# EasyEDA Pro project ProPrj_Dolphin 3D.epro, board PCB1
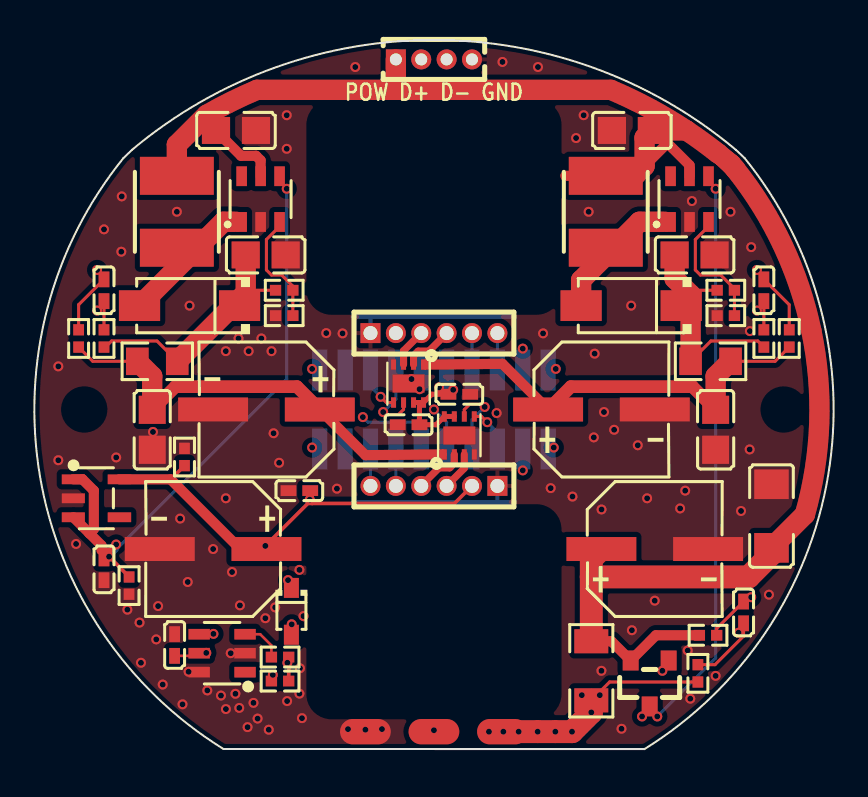
[diagram p3: board, top side]
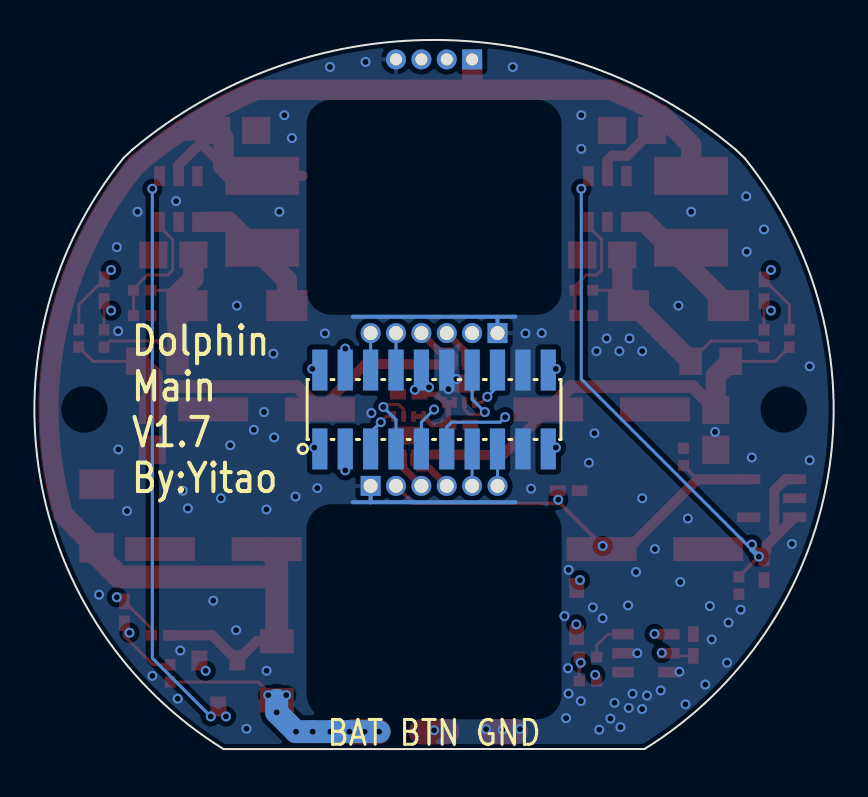
[diagram p4: board, bottom side, seen from below]

Outline 40 x 35.5 mm; copper layers: Top Layer, Inner1, Inner2, Bottom Layer. Coordinates in mm from the lower left corner of the outline.
Outline path: 4.89,30 4.46,29.58 arc(0.28,13.66) 9.46,0 30.53,0 arc(39.72,13.66) 35.54,29.59 35.1,30 arc(19.99,35.5) 4.89,30
Stack: Top Layer 0.035mm 外层铜厚1oz / Dielectric1 0.28mm 7628 RC49% 8.6mil / Inner1 0.035mm 内层铜厚 / Dielectric2 0.28mm 1.1mm H/HOZ 含铜 / Inner2 0.035mm 内层铜厚 / Dielectric3 0.28mm 7628 RC49% 8.6mil / Bottom Layer 0.035mm 外层铜厚1oz

## Design rules (mm)
net D+: DP1
net D-: DP1
template: 自定义配置
spacing copperThickness1oz (default): track to track 0.102, other pairs 0.127 to 0.3
spacing copperThickness2oz: track to track 0.203, other pairs 0.152 to 0.3
track width copperThickness1oz (default): min 0.127, default 0.254, max 2.54
track width copperThickness2oz: min 0.203, default 0.254, max 2.54
differential pair differentialPair (default): width min 0.127, default 0.254, max 2.54; gap min 0.152, default 0.152
via viaSize (default): diameter min 0.5, default 0.61, max 10; hole min 0.3, default 0.305, max 6.299

## Placement (name value [footprint] x y rotation side)
C1  470uF  [CAP-SMD_BD6.3-L6.6-W6.6-FD]  31.04 10.02 0 top
C2  1uF  [C0402]  3.48 9 270 top
C3  1uF  [C0402]  13.26 12.94 180 top
C9  100nF  [C0402]  21.26 17.76 0 top
C10  100nF  [C0402]  18.72 16.24 180 top
C17  470uF  [CAP-SMD_BD6.3-L6.6-W6.6-FD]  28.38 17 0 top
C18  470uF  [CAP-SMD_BD6.3-L6.6-W6.6-FD]  11.61 17 180 top
C19  470uF  [CAP-SMD_BD6.3-L6.6-W6.6-FD]  8.95 10.02 180 top
C29  100uF  [C1206]  36.89 11.67 270 top
C31  22uF  [C0805]  11.58 24.74 180 top
C35  22uF  [C0805]  5.9 15.98 90 top
C38  100nF  [C0402]  3.48 22.97 270 top
C39  22uF  [C0805]  10.09 30.97 180 top
C40  22uF  [C0805]  29.9 30.97 0 top
C41  22uF  [C0805]  33.04 24.74 180 top
C42  22uF  [C0805]  34.09 15.98 90 top
C43  100nF  [C0402]  36.5 22.97 270 top
C44  100nF  [C0402]  35.49 6.84 270 top
C45  10uF  [C0402]  7.02 5.21 90 top
CN2  PM127-1-06-4.3-G0  [HDR-TH_6P-P1.27-V-F]  19.99 20.83 0 top
CN3  PM127-1-06-4.3-G0  [HDR-TH_6P-P1.27-V-F]  19.99 13.17 180 top
D4  SS54  [SMA_L4.4-W2.8-LS5.4-R-RD]  7.77 22.2 180 top
D5  SS54  [SMA_L4.4-W2.8-LS5.4-R-RD]  29.86 22.2 180 top
D6  1N5819WS  [SOD-323_L1.8-W1.3-LS2.5-RD]  12.86 6.9 270 top
H3  PZ127V-11-04-H25  [HDR-TH_4P-P1.27-V-M]  19.99 34.53 0 top
L2  6.8uH  [IND-SMD_L4.0-W4.0_FNR4012S]  7.13 26.9 270 top
L3  6.8uH  [IND-SMD_L4.0-W4.0_FNR4012S]  28.59 26.9 270 top
NOREF  -  [Pad_e124]  19.99 0.87 0 top
NOREF#2  -  [Pad_e123]  23.42 0.87 0 top
NOREF#3  -  [Pad_e121]  16.57 0.87 0 top
Q1  AO3401A  [SOT-23_L2.9-W1.3-P1.90-LS2.4-BR]  30.79 3.28 90 top
R12  200kΩ  [R0402]  12.29 3.41 180 top
R15  1kΩ  [R0402]  12.29 4.61 0 top
R17  40mΩ  [R0805]  6.15 19.41 180 top
R21  1Ω  [R0402]  3.48 20.56 90 top
R22  1Ω  [R0402]  2.21 20.56 90 top
R23  174kΩ  [R0402]  12.5 22.97 0 top
R24  10kΩ  [R0402]  12.5 21.7 0 top
R25  174kΩ  [R0402]  34.6 22.97 0 top
R26  10kΩ  [R0402]  34.6 21.7 0 top
R27  40mΩ  [R0805]  33.84 19.41 0 top
R28  1Ω  [R0402]  36.5 20.56 90 top
R29  1Ω  [R0402]  37.77 20.56 90 top
R30  1Ω  [R0402]  33.71 5.7 0 top
R31  1Ω  [R0402]  33.2 3.79 90 top
R32  20mΩ  [R1206]  27.87 3.92 270 top
R33  200kΩ  [R0402]  7.51 14.62 90 top
R34  200kΩ  [R0402]  4.74 8.18 270 top
U1  RT9013-33GB  [SOT-23-5_L3.0-W1.7-P0.95-LS2.8-BL]  3.1 12.56 270 top
U4  DRV8837DSGR  [WSON-8_L2.0-W2.0-P0.50-TL-EP]  18.72 18.3 270 top
U5  DRV8837DSGR  [WSON-8_L2.0-W2.0-P0.50-TL-EP]  21.26 15.7 90 top
U8  MT3608L  [SOT-23-6_L2.9-W1.7-P0.95-LS2.8-BL]  11.32 27.53 0 top
U9  MT3608L  [SOT-23-6_L2.9-W1.7-P0.95-LS2.8-BL]  32.78 27.53 0 top
U10  KH-1.27FH-2X10P-H4.3-SMT  [CONN-SMD_20P-P1.27_KINGHELM_KH-1.27FH-2X10P-H4.3-SMT]  19.99 17 180 bottom
U13  -  [SOT-23-6_L2.9-W1.6-P0.95-LS2.8-BL]  9.39 4.8 90 top

## Footprints (pads in the part's own frame, mm; a bottom-side part is the same pattern mirrored in y, then rotated)
C0402
  rect 0.79x0.54 smd: 1(-0.545,0) 2(0.545,0)
C0805
  rect 1.41x1.35 smd: 1(-1,0) 2(1,0)
C1206
  rect 1.485x1.728 smd: 1(-1.593,0) 2(1.593,0)
CAP-SMD_BD6.3-L6.6-W6.6-FD
  rect 3.5x1.2 smd: 1(-2.67,0) 2(2.67,0)
CONN-SMD_20P-P1.27_KINGHELM_KH-1.27FH-2X10P-H4.3-SMT
  rect 0.76x2.05 smd: 1(-5.715,-1.975) 2(-5.715,1.975) 3(-4.445,-1.975) 4(-4.445,1.975) 5(-3.175,-1.975) 6(-3.175,1.975) 7(-1.905,-1.975) 8(-1.905,1.975) 9(-0.635,-1.975) 10(-0.635,1.975) 11(0.635,-1.975) 12(0.635,1.975) 13(1.905,-1.975) 14(1.905,1.975) 15(3.175,-1.975) 16(3.175,1.975) 17(4.445,-1.975) 18(4.445,1.975) 19(5.715,-1.975) 20(5.715,1.975)
HDR-TH_4P-P1.27-V-M
  rect 1x1 hole 0.6: 1(-1.905,0)
  round 1 hole 0.6: 2(-0.635,0) 3(0.635,0) 4(1.905,0)
HDR-TH_6P-P1.27-V-F
  rect 1x1 hole 0.7: 1(-3.175,0)
  round 1 hole 0.7: 2(-1.905,0) 3(-0.635,0) 4(0.635,0) 5(1.905,0) 6(3.175,0)
IND-SMD_L4.0-W4.0_FNR4012S
  rect 1.9x3.7 smd: 1(-1.8,0) 2(1.8,0)
Pad_e121
  oval 2.54x1.27 smd: 18(0,0)
Pad_e123
  oval 2.54x1.27 smd: 18(0,0)
Pad_e124
  oval 2.54x1.27 smd: 18(0,0)
R0402
  rect 0.566x0.54 smd: 1(-0.433,0) 2(0.433,0)
R0805
  rect 1.133x1.377 smd: 1(-1,0) 2(1,0)
R1206
  rect 1.208x1.701 smd: 1(-1.479,0) 2(1.479,0)
SMA_L4.4-W2.8-LS5.4-R-RD
  rect 2.062x1.539 smd: 1(2.503,0) 2(-2.503,0)
SOD-323_L1.8-W1.3-LS2.5-RD
  rect 1x0.75 smd: 1(-1.173,0) 2(1.173,0)
SOT-23-5_L3.0-W1.7-P0.95-LS2.8-BL
  rect 0.49x1.157 smd: 1(-0.95,-1.153) 2(0,-1.153) 3(0.95,-1.153)
  rect 0.49x1.175 smd: 4(0.95,1.153) 5(-0.95,1.153)
SOT-23-6_L2.9-W1.6-P0.95-LS2.8-BL
  rect 0.532x1.072 smd: 1(-0.95,-1.149) 2(0,-1.149) 3(0.95,-1.149) 4(0.95,1.149) 5(0,1.149) 6(-0.95,1.149)
SOT-23-6_L2.9-W1.7-P0.95-LS2.8-BL
  rect 0.532x0.99 smd: 1(-0.95,-1.145) 2(0,-1.145) 3(0.95,-1.145) 4(0.95,1.145) 5(0,1.145) 6(-0.95,1.145)
SOT-23_L2.9-W1.3-P1.90-LS2.4-BR
  rect 1x0.8 smd: 1(1.15,-0.95) 2(1.15,0.95) 3(-1.15,0)
WSON-8_L2.0-W2.0-P0.50-TL-EP
  rect 0.521x0.25 smd: 1(-0.95,0.75) 2(-0.95,0.25) 3(-0.95,-0.25) 4(-0.95,-0.75) 5(0.95,-0.75) 6(0.95,-0.25) 7(0.95,0.25) 8(0.95,0.75)
  rect 0.9x1.6 smd: 9(0,0)

## Nets
As in the schematic, except:
GND: C1.2 C2.2 C3.2 C9.2 C10.2 C17.2 C18.2 C19.2 C29.1 C31.1 C35.1 C39.1 C40.1 C41.1 C42.1 C45.2 CN2.1 CN3.1 H3.4 NOREF#3.18 R24.1 R26.1 R33.2 R34.2 U1.2 U4.4 U4.9 U5.4 U5.9 U8.2 U9.2 U10.12 U10.17 U10.18 U13.2 U13.6
BAT: D6.2 NOREF#2.18 R12.2 R31.1 R32.2
BTN: NOREF.18 U13.4

Pads without a net: U1 4; U8 6; U9 6; U13 1

## Via types
v1: diameter 0.5, hole 0.3, Top Layer to Bottom Layer, 101 vias
v2: diameter 0.5, hole 0.299, Top Layer to Bottom Layer, 37 vias

## Routing (per net, layer and track width the routed paths; a pad name or vN(x,y) marks a point on that pad's centre or on a via; arc(x,y) is an arc through that point)
+3V3: length 47.9
  Top Layer w0.178: 13.9,12.3 13.68,12.3 v1(11.56,10.17) ; 13.9,12.3 21.02,12.3 CN3.2 ; 13.9,12.3 13.9,12.84 C3.1 ; R33.1 6.83,13.5 6.81,13.5
  Top Layer w0.254: 19.27,17.35 U4.7 ; 19.27,17.35 U4.8 19.89,17.76 20.72,17.76 ; 19.27,17.35 19.27,16.24 20.1,16.24 U5.8 U5.7
  Top Layer w0.508: 4.26,13.5 6.81,13.5 10.15,10.17 v1(11.56,10.17)
  Inner1 w0.178: CN3.2 21.02,12.3 13.97,12.3 v1(13.78,12.48) 13.78,12.39 v1(11.56,10.17)
  Inner2 w0.66: CN2.2 18.09,20.56 21.9,16.75 CN3.2
  vias: v1(20.25,18.11) v1(20.96,17.99)
GND: length 26.4
  Inner1 w0.203: v2(17.39,1) 17.84,1.45 25.74,1.45
  Bottom Layer w0.203: 23.17,12.36 23.17,12.36 CN3.1 ; 23.17,12.36 15.93,12.36 ; 23.17,12.36 24.06,12.36 ; 16.82,21.64 24.06,21.64 ; 16.82,21.64 15.93,21.64 ; 16.82,21.64 CN2.1
  vias: v1(1.2,19.16) v1(1.2,14.46) v1(2.09,10.27) v1(3.48,26.02) v1(4.37,27.67) v1(4.35,24.9) v1(4.65,6.98) v1(5.26,6.33) v1(5.33,4.32) v1(5.94,15.88) v1(6.1,5.49) v1(6.19,7.16) v1(6.42,3.23) v1(7.13,26.9) v1(7.29,11.54) v1(7.41,2.24) v1(7.68,8.36) v1(7.72,3.87) v1(7.77,22.2) v1(8.95,10.01) v1(9.58,12.56) v1(9.59,2) v1(9.83,4.8) v1(9.89,8.86) v1(10.29,7.19) v1(10.25,2.06) v1(10.72,19.92) v1(10.67,1.1) v1(10.96,2.31) v1(11.56,6.55) v1(11.73,0.97) v1(11.97,15.81) v1(12.05,7.09) v1(12.25,14.33) v1(12.63,31.73) v1(12.63,30.05) v1(13.26,8.97) v1(13.26,2.78) v1(13.39,1.55) v1(14.61,20.83) v1(15.14,13.04) v1(16.06,34.14) v1(18.87,18.52) v1(19.28,18.02) v1(23.13,16.82) v1(23.42,34.4) v1(25.2,34.14) v1(25.46,20.81) v1(25.84,13.06) v1(26.93,12.64) v1(27.11,30.59) v1(27.49,31.73) v1(27.74,26.9) v1(28.04,19.8) v1(28.38,12) v1(28.38,3.92) v1(28.5,16.87) v1(29.86,22.2) v1(29.9,5.95) v1(30.19,15.21) v1(31.04,7.43) v1(32.31,12.05) v1(32.9,27.44) v1(34.83,26.9) v1(35.36,11.92) v1(35.81,20.92) v1(35.79,15) v1(35.87,25.13) v1(36.76,7.73) v2(4.09,14.6) v2(8.65,2.94) v2(9.34,2.68) v2(9.58,19.92) v2(10.06,2.77) v2(10.22,20.56) v2(11.17,1.53) v2(11.36,20.56) v2(11.87,19.92) v2(12.65,2.4) v2(13.29,4.05) v2(13.47,6.66) v2(15.42,20.81) v2(15.69,1) v2(16.57,0.97) v2(28,15.6) v2(29.01,15.98) v2(29.38,1.02) v2(30.66,12.56) v2(32.57,12.94) v2(32.69,4.94) v2(32.82,2.52) v2(34.09,3.67)
VCC: length 91.4
  Top Layer w0.178: R34.1 4.74,8.63 4.29,9.08 4.29,9.08 v1(3.74,9.63)
  Top Layer w0.254: v2(4.09,10.24) 3.8,9.95 3.36,9.95
  Top Layer w0.508: 2.76,10.8 2.98,11.02 2.98,12.94 2.41,13.5 1.95,13.5 ; 2.76,10.8 3.36,10.2 3.36,9.95 ; 2.76,10.8 U1.3
  Inner1 w0.254: v1(3.74,9.63) 3.74,6.86 10.25,0.34 29.88,0.34 v1(31.17,1.63)
  Bottom Layer w0.152: v1(12.63,28.05) 12.63,18.52 4.09,9.99 ; v1(34.09,28.05) 34.09,4.55 v1(31.17,1.63)
  Bottom Layer w0.254: v2(4.09,10.24) 4.09,9.99 v1(3.74,9.63)
  vias: v2(30.41,1.63)
+VM1: length 22.3
  Top Layer w0.152: 37.77,20.12 37.06,19.41 R27.2
  Top Layer w0.508: C17.1 23.42,19.29 19.61,19.25
  Top Layer w0.635: C42.2 32.93,18.14 26.85,18.14 C17.1
  Top Layer w1.016: R27.2 34.09,18.67 C42.2
+VM2: length 22.3
  Top Layer w0.152: 2.21,20.12 2.92,19.41 R17.2
  Top Layer w0.508: 20.38,14.75 16.57,14.71 C18.1
  Top Layer w0.635: C35.2 7.06,18.14 13.14,18.14 C18.1
  Top Layer w1.016: R17.2 5.9,18.67 C35.2
BAT: length 38.4
  Top Layer w0.152: R31.1 28.79,3.36 R32.2
  Top Layer w1.143: R32.2 v2(27.87,1.84) v2(26.9,0.87) v1(26.07,0.87) v1(25.19,0.87) v2(24.23,0.87)
  Inner1 w0.127: v1(12.88,6.25) 11.93,5.3 v1(11.93,3.72)
  Inner2 w0.127: v2(22.75,0.87) 22.69,0.87 22.29,0.48 13.24,0.48 11.93,1.78 v1(11.93,3.72)
  Inner2 w0.508: v2(22.75,0.87) v2(23.47,0.87) v2(24.23,0.87) v1(25.19,0.87) v1(26.07,0.87) v2(26.9,0.87) v2(27.87,1.84)
  Bottom Layer w1.143: R32.2 v2(27.87,1.84) v2(26.9,0.87) v1(26.07,0.87) v1(25.19,0.87) v2(24.23,0.87) v2(23.47,0.87) v2(22.75,0.87)
  vias: v2(27.39,2.7) v2(28.29,2.7)
BTN: length 37.3
  Inner2 w0.152: v2(19.99,0.94) 20.4,1.35 25.52,1.35 26.4,2.22 26.4,11.53 25.65,12.28 14.34,12.28 8.96,6.9 v2(8.96,5.77)
D+: length 29
  Inner2 w0.152: v1(16.44,16.62) 16.44,17.28 16.54,17.38 16.54,17.46 13.14,20.86 13.14,32.54 13.77,33.18 18.63,33.18 19.36,33.91 H3.2
  Bottom Layer w0.152: U10.11 19.36,16.13 19.12,16.36 16.69,16.36 v1(16.44,16.62)
D-: length 31
  Inner2 w0.152: H3.3 20.4,34.53 18.75,32.88 13.9,32.88 13.44,32.42 13.44,20.99 16.84,17.58 16.84,17.38 16.95,17.28 16.95,16.62 17.2,16.36 19.36,16.36 v1(19.99,17)
  Bottom Layer w0.152: U10.9 20.63,16.36 v1(19.99,17)
M1A: length 3.9
  Top Layer w0.152: U4.6 18.47,17 18.22,16.75 17.58,16.75 v1(17.45,16.87)
  Bottom Layer w0.152: U10.14 18.09,17.51 v1(17.45,16.87)
M1B: length 2.3
  Top Layer w0.152: v1(17.33,17.64) 17.61,17.35 U4.5
  Bottom Layer w0.152: v1(17.33,17.64) 16.82,18.14 U10.16
M1EA: length 1.9
  Bottom Layer w0.152: CN2.6 U10.6
M1EB: length 1.9
  Bottom Layer w0.152: CN2.5 U10.8
M2A: length 3.9
  Top Layer w0.152: v1(22.53,17.13) 22.41,17.25 21.77,17.25 21.51,17 U5.6
  Bottom Layer w0.152: v1(22.53,17.13) 21.9,16.49 U10.7
M2B: length 2.3
  Top Layer w0.152: v1(22.66,16.36) 22.38,16.65 U5.5
  Bottom Layer w0.152: v1(22.66,16.36) 23.17,15.86 U10.5
M2EA: length 1.9
  Bottom Layer w0.152: CN3.6 U10.15
M2EB: length 1.9
  Bottom Layer w0.152: CN3.5 U10.13
VB+: length 17.7
  Top Layer w0.152: 33.2,4.22 34.06,4.22 35.49,5.66 C44.2
  Inner2 w0.152: v1(35.23,5.82) 27.11,13.95 v1(24.44,13.95)
VB-: length 21.4
  Top Layer w0.152: R30.2 34.14,6.04 C44.1
  Inner2 w0.152: v1(35.87,7.6) 34.71,7.6 28.1,14.21 25.84,14.21 24.44,15.6 v1(24.44,20.05)
VM1+: length 14.4
  Top Layer w0.152: R28.2 C43.2
  Inner2 w0.152: v1(36.16,21.95) 35.61,21.4 29.3,15.09 v1(25.99,15.09)
VM1-: length 15.2
  Top Layer w0.152: R29.2 37.77,22.24 C43.1
  Inner2 w0.152: v1(26.09,19.03) 31.2,19.03 v1(36.16,23.99)
VM2+: length 15
  Top Layer w0.152: R21.2 C38.2
  Inner2 w0.152: v1(13.9,15.09) 10,15.09 v1(3.14,21.95)
VM2-: length 15.9
  Top Layer w0.152: C38.1 2.21,22.24 R22.2
  Inner2 w0.152: v1(3.14,23.99) 8.09,19.03 v1(13.9,19.03)
VPOW: length 95.7
  Top Layer w0.127: 34.17,29.32 34.52,29.06 ; 34.17,29.32 33.84,29.56 ; 34.17,29.32 34.77,28.78 ; 34.17,29.32 33.93,29.48 ; 34.17,29.32 34.77,28.73 ; 35.18,29.59 35.24,29.54 ; 35.18,29.59 35.08,29.67 arc(34.79,29.91) 34.5,30.15 34.2,30.36 35.16,29.6 ; 35.18,29.59 34.69,29.94
  Top Layer w0.508: 32.78,28.68 32.78,29.23 31.68,30.33 30.54,29.19 ; C39.2 9.09,30.95 10.34,29.7 11.09,29.7 11.32,29.47 11.32,28.68 ; R30.1 31.1,5.7 Q1.2 28.88,5.4 R32.1 ; L3.1 26.57,28.7
  Top Layer w0.889: 35.08,29.02 34.25,29.86 34.15,29.86
  Top Layer w1.016: C29.2 38.56,11.75 arc(39.28,16.33) 38.88,20.94 arc(37.46,25.21) 35.08,29.02 arc(35,29.12) 34.92,29.22 ; H3.1 18.09,33.51 ; L3.1 30.04,28.7 30.54,29.19 30.54,30.61 C40.2 32.63,30.97 ; 32.63,30.97 arc(30.79,32.08) 28.85,33 11.14,33 arc(9.87,32.42) 8.63,31.76 7.13,30.25 L2.1 ; 32.63,30.97 arc(33.4,30.43) 34.15,29.86
  Top Layer w1.143: C1.1 27.87,9.51 27.87,8.62 ; 27.87,8.62 35.74,8.62 36.89,9.76 C29.2 ; 27.87,8.62 R32.1
$1N5624: length 26.8
  Top Layer w0.178: R15.2 R12.1
  Inner2 w0.152: v1(31.42,3.92) 27.74,0.24 13.14,0.24 11.44,1.93 11.44,3.9 11.86,4.32 v1(12.66,4.32)
$1N6475: length 6.6
  Top Layer w1.016: D4.1 9.46,26.4 10.09,26.4
$1N6476: length 13.1
  Top Layer w0.152: R17.1 6.14,20.43 3.87,20.43 3.56,20.12 3.48,20.12 ; D4.2 11.04,22.97 R23.1
  Top Layer w1.016: R17.1 10.58,22.84 C31.2
$1N7010: length 6.7
  Top Layer w1.016: D5.1 27.36,23.48 30.28,26.4 31.55,26.4
$1N7011: length 12
  Top Layer w0.152: D5.2 32.84,22.67 33.14,22.97 R25.1 ; R27.1 33.85,20.43 36.2,20.43 36.5,20.12
  Top Layer w1.016: R27.1 32.84,22.76 32.04,23.56 C41.2
$1N9610: length 2.6
  Top Layer w0.355: CN2.4 20.63,20.81 19.74,19.92 19.21,19.92 18.97,19.69 U4.2
$1N9613: length 1.9
  Top Layer w0.355: CN2.3 18.47,19.94 U4.3
$1N9728: length 2.6
  Top Layer w0.355: U5.2 21.01,14.31 20.78,14.08 20.25,14.08 19.36,13.19 CN3.4
$1N9730: length 1.9
  Top Layer w0.355: U5.3 21.51,14.06 CN3.3
$1N12478: length 5.8
  Top Layer w0.152: 12.27,26.38 12.27,26.17 11.61,25.51 11.61,23.98 11.87,23.73 12.37,23.73 12.93,23.17 R23.2 R24.2
$1N12591: length 6.4
  Top Layer w0.152: R26.2 35.03,23.04 34.35,23.73 33.33,23.73 33.08,23.98 33.08,25.51 33.73,26.17 33.73,26.38
$1N20656: length 6.9
  Top Layer w0.127: U13.5 8.11,4.67 C45.1
  Inner2 w0.127: v2(8.6,4.82) 9.05,4.82 v2(12.69,8.46)
$1N20702: length 2.1
  Top Layer w0.127: R15.1 11.86,5.19 11.3,5.75 U13.3

## Copper pours and planes (outline as drawn; the poured copper is in the pictures)
GND on Top Layer: -4.9,38.21 40.95,38.21 40.95,-0.78 -4.9,-0.78
GND on Bottom Layer: -3.88,37.32 41.97,37.32 41.97,-1.67 -3.88,-1.67
GND on Inner1: -2.87,36.43 42.98,36.43 42.98,-2.56 -2.87,-2.56
GND on Inner2: -1.6,35.29 44.25,35.29 44.25,-3.7 -1.6,-3.7

## Text on the board
Bottom Silkscreen Layer: BAT BTN GND | Dolphin / Main / V1.7 / By:Yitao
Top Silkscreen Layer: POW D+ D- GND
